# Altium schematic sheet Power Supply.SchDoc: Power Supply (part 2 of 2)
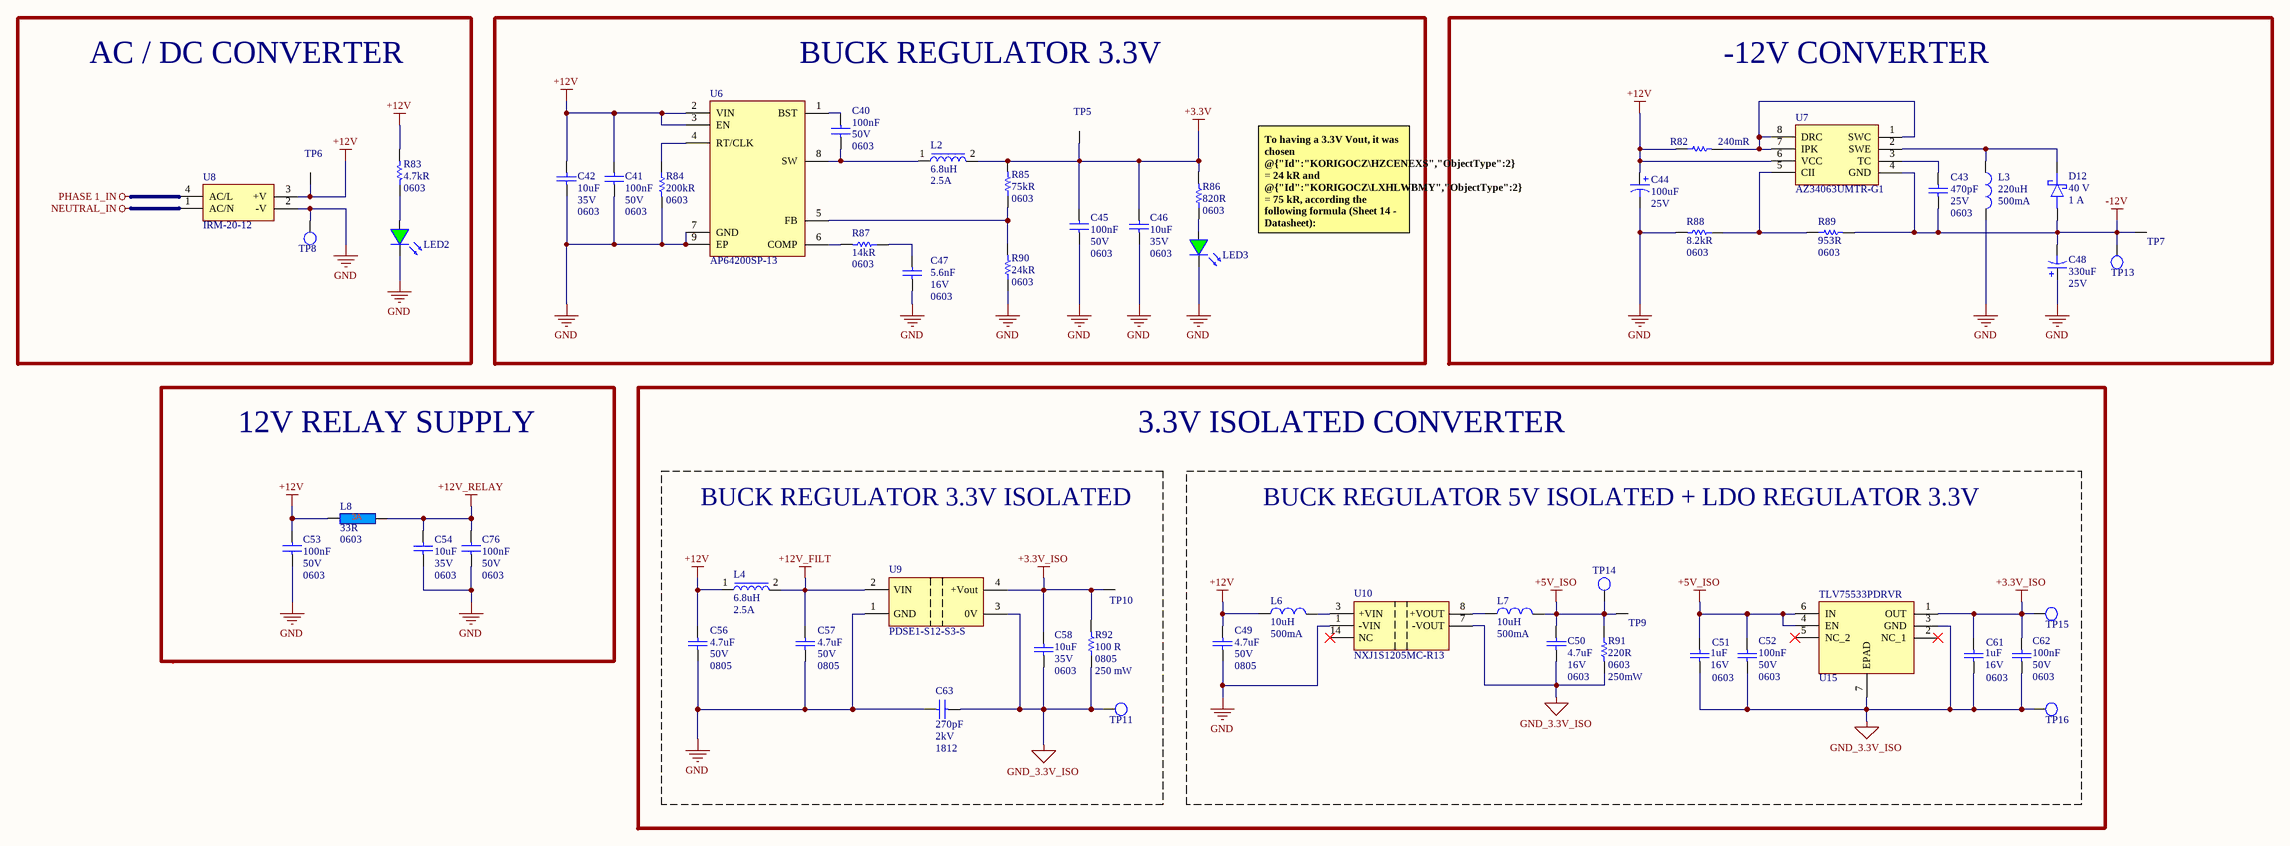
[diagram p1: Power Supply.SchDoc]

## Library data of the parts
C40 C41 C45 C52 C53 C62 C76 = C_0603_0.1uF_50V_20%: Cap Ceramic 50V 20% +Tol 20% -Tol X7R 15% TC 0.1uF SMD 0603; Manufacturer: Yageo; Supplier 1: Arrow Electronics; Manufacturer Part Number: CC0603MRX7R9BB104; RoHS: Yes; Category: Ceramic Capacitors; Stock 1: 19775; Pricing 1: 4000=0,00850, 8000=0,00780, 12000=0,00740, 28000=0,00700, 100000=0,00520 (USD); Mounting Technology: Surface Mount; Case Code (Imperial): 0603; Case Code (Metric): 1608; Min Operating Temperature: -55°C; Max Operating Temperature: 125°C; Packaging: Tape and Reel; Tolerance: 20%; Dielectric: X7R; Voltage Rating (DC): 50V; Series: CC; Length: 0.063inch; Width: 0.031inch; Thickness: 0.035inch; Lead Free: Lead Free; Halogen Free: Halogen Free; RoHS Compliant: Yes; ComponentLink1URL: http://www.yageo.com/documents/recent/UPY-GPHC_X7R_6.3V-to-50V_18.pdf?src-supplier=Digi-Key; ComponentLink1Description: http://www.yageo.com/documents/recent/UPY-GPHC_X7R_6.3V-to-50V_18.pdf?src-supplier=Digi-Key; ComponentLink2URL: https://www.yageo.com/upload/media/product/productsearch/datasheet/mlcc/UPY-GPHC_X7R_6.3V-to-50V_18.pdf?src-supplier=Digi-Key; ComponentLink2Description: https://www.yageo.com/upload/media/product/productsearch/datasheet/mlcc/UPY-GPHC_X7R_6.3V-to-50V_18.pdf?src-supplier=Digi-Key; ComponentLink3URL: http://www.yageo.com/exep/pages/download/literatures/ProductSelectionGuide%202014_Final_2.pdf?src-supplier=Digi-Key; ComponentLink3Description: http://www.yageo.com/exep/pages/download/literatures/ProductSelectionGuide%202014_Final_2.pdf?src-supplier=Digi-Key; Supplier Part Number 1: CC0603MRX7R9BB104
C42 C46 C54 C58 = C_0603_10uF_35V_20%: Cap Ceramic 10uF 35V X5R 20% Pad SMD 0603 85C T/R; Manufacturer: Murata; Manufacturer Part Number: GRM188R6YA106MA73D; Supplier 1: Arrow Electronics; RoHS: Yes; Category: Ceramic Capacitors; Stock 1: 32291; Pricing 1: 1=0,31230, 10=0,18330, 25=0,18150, 100=0,12390, 250=0,12260, 500=0,08640, 1000=0,08550, 3000=0,07600, 6000=0,06650, 15000=0,06580, 30000=0,05360 (USD); Mount: Surface Mount; Case Code (Metric): 1608; Case Code (Imperial): 0603; Min Operating Temperature: -55°C; Max Operating Temperature: 85°C; Packaging: Tape and Reel; Voltage Rating (DC): 35V; Dielectric: X5R; Length: 0.063inch; Width: 0.031inch; Thickness: 0.039inch; RoHS Compliant: Yes; ComponentLink1URL: http://search.murata.co.jp/Ceramy/image/img/A01X/G101/ENG/GRM188R6YA106MA73-01.pdf?src-supplier=Future+Electronics; ComponentLink1Description: http://search.murata.co.jp/Ceramy/image/img/A01X/G101/ENG/GRM188R6YA106MA73-01.pdf?src-supplier=Future+Electronics; ComponentLink2URL: http://search.murata.co.jp/Ceramy/image/img/A01X/G101/ENG/GRM188R6YA106MA73-01.pdf?src-supplier=Digi-Key; ComponentLink2Description: http://search.murata.co.jp/Ceramy/image/img/A01X/G101/ENG/GRM188R6YA106MA73-01.pdf?src-supplier=Digi-Key; ComponentLink3URL: https://www.murata.com/~/media/webrenewal/support/library/catalog/products/capacitor/mlcc/c02e.ashx?la=en-us&src-supplier=Digi-Key; ComponentLink3Description: https://www.murata.com/~/media/webrenewal/support/library/catalog/products/capacitor/mlcc/c02e.ashx?la=en-us&src-supplier=Digi-Key; ComponentLink4URL: http://search.murata.co.jp/Ceramy/image/img/A01X/G101/ENG/GRM188R6YA106MA73-01.pdf?src-supplier=Mouser; ComponentLink4Description: http://search.murata.co.jp/Ceramy/image/img/A01X/G101/ENG/GRM188R6YA106MA73-01.pdf?src-supplier=Mouser; ComponentLink5URL: http://search.murata.co.jp/Ceramy/image/img/A01X/G101/ENG/GRM188R6YA106MA73-01.pdf?src-supplier=TTI; ComponentLink5Description: http://search.murata.co.jp/Ceramy/image/img/A01X/G101/ENG/GRM188R6YA106MA73-01.pdf?src-supplier=TTI; Tolerance: 20%; Supplier Part Number 1: GRM188R6YA106MA73D
C43 = C_0603_470pF_25V_10%: CHIP CAP-470PF-25V-10%-X7R-0603; Manufacturer: Yageo; Tolerance: 10%; Dielectric: X7R; Supplier 1: Digi-Key; Manufacturer Part Number: CC0603KRX7R8BB471; RoHS: Yes; Category: Ceramic Capacitors; Stock 1: 19214; Pricing 1: 1=0,10000, 10=0,04800, 50=0,02620, 100=0,02140, 500=0,01528, 1000=0,01200 (USD); Mounting Technology: Surface Mount; Case Code (Imperial): 0603; Case Code (Metric): 1608; Weight: 7.1E-05oz; Min Operating Temperature: -55°C; Max Operating Temperature: 125°C; Voltage Rating (DC): 25V; Packaging: Tape and Reel; Termination: SMD/SMT; Resistor Type: Ceramic; Series: CC; Length: 0.063inch; Width: 0.031inch; Thickness: 0.035inch; Lead Free: Lead Free; Halogen Free: Halogen Free; RoHS Compliant: Yes; ComponentLink1URL: https://datasheet.ciiva.com/13208/upy-gphc-x7r-6-3v-to-50v-8-12304-13208058.pdf?src-supplier=Mouser; ComponentLink1Description: https://datasheet.ciiva.com/13208/upy-gphc-x7r-6-3v-to-50v-8-12304-13208058.pdf?src-supplier=Mouser; Supplier Part Number 1: 311-4087-1-ND
C44 = C_6.6mm X 6.6mm_100uF_25V_20%: Smd Aluminium Electrolytic Capacitor, Wcap-Asli Series, 100 uF, 25 V, Radial Can - Smd, 6.3 Mm Rohs Compliant: Yes; Manufacturer: Wurth Electronics; Tolerance: 20%; Life (Hours): 2000Hour; Ripple Current (AC): 290mA; Impedance: 380mR; Supplier 1: Rs; Manufacturer Part Number: 865080445010; RoHS: Yes; Category: Aluminum Electrolytic Capacitors; Stock 1: 360; Pricing 1: 50=0,22900, 100=0,19600, 200=0,18600, 1000=0,15200 (GBP); Mounting Technology: Surface Mount; Case/Package: Radial; Material: Aluminium; Min Operating Temperature: -55°C; Max Operating Temperature: 105°C; Voltage Rating: 25V; Packaging: Cut Tape; Series: WCAP-ASLI; Diameter: 6.3mm; Height: 7.7mm; RoHS Compliant: Yes; ComponentLink1URL: https://datasheet.ciiva.com/48693/001280461-da-01-en-wcap-asli-alu-elec-caps-865080445010-48693637.pdf?src-supplier=Conrad; ComponentLink1Description: https://datasheet.ciiva.com/48693/001280461-da-01-en-wcap-asli-alu-elec-caps-865080445010-48693637.pdf?src-supplier=Conrad; Supplier Part Number 1: 8391824P
C47 = C_0603_5600pF_16V_10%: Capacitor, Ceramic, 5.6nF, 16VDC, 10-% Tol, 10+% Tol, X7R-TC Code, -15, 15%-TC RoHS Compliant: Yes; Manufacturer: KEMET; Tolerance: 10%; Dielectric: X7R; Supplier 1: Mouser; Manufacturer Part Number: C0603C562K4RACTU; RoHS: Yes; Category: Ceramic Capacitors; Stock 1: 10749; Pricing 1: 1=0,29000, 10=0,20200, 50=0,20200, 100=0,10300, 1000=0,06200, 10000=0,05400 (USD); Mounting Technology: Surface Mount; Case/Package: 0603; Dielectric Material: Ceramic; Case Code (Metric): 1608; Min Operating Temperature: -55°C; Max Operating Temperature: 125°C; Packaging: Tape and Reel; Voltage Rating (DC): 16V; Package Quantity: 4000; Termination: SMD/SMT; Dissipation Factor: 10%; Series: SMD Comm X7R; Length: 1.6mm; Width: 0.8mm; Height: 0.8mm; Lead Pitch: 0.7mm; RoHS Compliant: Yes; ComponentLink1URL: http://www.mouser.com/ds/2/212/KEM_C1002_X7R_SMD-1102033.pdf?src-supplier=Mouser; ComponentLink1Description: http://www.mouser.com/ds/2/212/KEM_C1002_X7R_SMD-1102033.pdf?src-supplier=Mouser; ComponentLink2URL: http://components.arrow.com/part/dataview/2627857S8405979N7429?src-supplier=Arrow+Electronics; ComponentLink2Description: http://components.arrow.com/part/dataview/2627857S8405979N7429?src-supplier=Arrow+Electronics; ComponentLink3URL: https://search.kemet.com/component-edge/download/datasheet/C0603C562K4RACTU.pdf?src-supplier=Digi-Key; ComponentLink3Description: https://search.kemet.com/component-edge/download/datasheet/C0603C562K4RACTU.pdf?src-supplier=Digi-Key; Supplier Part Number 1: 80-C0603C562K4R
C48 = C_8mm X 10mm_330uF_25V_20%: Aluminum Electrolytic Capacitor, 330uF 25 V dc, WT Series 1000h 8 (Dia.) x 10mm; Manufacturer: Nichicon; Dielectric Material: Aluminium; Tolerance: 20%; Ripple Current: 190mA; Leakage Current: 3uA; Life (Hours): 1000Hour; Dissipation Factor: 0.16%; Supplier 1: Rs; Manufacturer Part Number: UWT1E331MNL1GS; RoHS: Yes; Category: Aluminum Electrolytic Capacitors; Stock 1: 2550; Pricing 1: 125=0,00752, 625=0,15700, 1875=0,12600, 3750=0,12000 (GBP); Mounting Technology: Surface Mount,PCB; Case/Package: Radial; Pins: 2; Min Operating Temperature: -55°C; Max Operating Temperature: 105°C; Package Quantity: 500; Packaging: Tape and Reel; Voltage Rating (DC): 25V; Termination: SMD/SMT; Voltage: 25V; Ripple Current (AC): 190mA; Series: WT; Construction: Cylindrical; Diameter: 8mm; Length: 10mm; Height: 10mm; Height - Seated (Max): 0.394inch; Radiation Hardening: No; Reach SVHC Compliant: Yes; Lead Free: Lead Free; RoHS Compliant: Yes; ComponentLink1URL: https://datasheet.ciiva.com/97/e-wt-97107.pdf?src-supplier=Digi-Key; ComponentLink1Description: https://datasheet.ciiva.com/97/e-wt-97107.pdf?src-supplier=Digi-Key; ComponentLink2URL: https://datasheet.ciiva.com/97/e-wt-97108.pdf?src-supplier=Digi-Key; ComponentLink2Description: https://datasheet.ciiva.com/97/e-wt-97108.pdf?src-supplier=Digi-Key; ComponentLink3URL: https://datasheet.ciiva.com/97/e-wt-97109.pdf?src-supplier=Digi-Key; ComponentLink3Description: https://datasheet.ciiva.com/97/e-wt-97109.pdf?src-supplier=Digi-Key; ComponentLink4URL: https://datasheet.ciiva.com/30522/getdatasheetpartid-457641-30522227.pdf?src-supplier=Verical; ComponentLink4Description: https://datasheet.ciiva.com/30522/getdatasheetpartid-457641-30522227.pdf?src-supplier=Verical; ComponentLink5URL: https://datasheet.ciiva.com/11782/0900766b80649b51-11782007.pdf?src-supplier=Rs; ComponentLink5Description: https://datasheet.ciiva.com/11782/0900766b80649b51-11782007.pdf?src-supplier=Rs; ComponentLink6URL: https://datasheet.ciiva.com/11686/e-wt-11686502.pdf?src-supplier=Avnet; ComponentLink6Description: https://datasheet.ciiva.com/11686/e-wt-11686502.pdf?src-supplier=Avnet; ComponentLink7URL: https://datasheet.ciiva.com/16502/e-wt-16502936.pdf?src-supplier=Future+Electronics; ComponentLink7Description: https://datasheet.ciiva.com/16502/e-wt-16502936.pdf?src-supplier=Future+Electronics; ComponentLink8URL: https://datasheet.ciiva.com/7851/e-wt-7851757.pdf?src-supplier=Element14; ComponentLink8Description: https://datasheet.ciiva.com/7851/e-wt-7851757.pdf?src-supplier=Element14; Supplier Part Number 1: 5201933P
C49 C56 C57 = C_0805_4.7uF_50V_20%: 0805 4.7 uF 50 V ±20% Tolerance X5R Surface Mount Multilayer Ceramic Capacitor; Manufacturer: Murata; Supplier 1: Arrow Electronics; Manufacturer Part Number: GRM21BR61H475ME51L; RoHS: Yes; Category: Ceramic Capacitors; Stock 1: 9948; Pricing 1: 1=0,21500, 10=0,12180, 25=0,12060, 100=0,08430, 250=0,08340, 500=0,05930, 1000=0,05140, 3000=0,04790, 6000=0,03900 (USD); Mounting Technology: Surface Mount; Case Code (Imperial): 0805; Case Code (Metric): 2012; Weight: 0.000335oz; Min Operating Temperature: -55°C; Max Operating Temperature: 85°C; Tolerance: 20%; Packaging: Tape and Reel; Dielectric: X5R; Termination: SMD/SMT; Resistor Type: Ceramic; Voltage Rating (DC): 50V; Package Quantity: 3000; Length: 2mm; Width: 0.049inch; Height: 1.25mm; Thickness: 0.055inch; Depth: 1.2mm; RoHS Compliant: Yes; ComponentLink1URL: http://www.mouser.com/ds/2/281/c02e-2905.pdf?src-supplier=Mouser; ComponentLink1Description: http://www.mouser.com/ds/2/281/c02e-2905.pdf?src-supplier=Mouser; ComponentLink2URL: http://search.murata.co.jp/Ceramy/image/img/A01X/G101/ENG/GRM21BR61H475ME51-01.pdf?src-supplier=Digi-Key; ComponentLink2Description: http://search.murata.co.jp/Ceramy/image/img/A01X/G101/ENG/GRM21BR61H475ME51-01.pdf?src-supplier=Digi-Key; ComponentLink3URL: https://search.murata.co.jp/Ceramy/image/img/A01X/G101/ENG/GRM21BR61H475ME51-01.pdf?src-supplier=Digi-Key; ComponentLink3Description: https://search.murata.co.jp/Ceramy/image/img/A01X/G101/ENG/GRM21BR61H475ME51-01.pdf?src-supplier=Digi-Key; Supplier Part Number 1: GRM21BR61H475ME51L
C50 = C_0603_4.7uF_16V_10%: CAP CER 4.7UF 16V X5R 0603; Manufacturer: Samsung; Material: Ceramic; Tolerance: 10%; Supplier 1: Mouser; Manufacturer Part Number: CL10A475KO8NNNC; RoHS: Yes; Category: Ceramic Capacitors; Stock 1: 437083; Pricing 1: 1=0,12000, 10=0,08600, 50=0,08600, 100=0,04100, 1000=0,02400, 10000=0,01700 (USD); Mounting Technology: Surface Mount; Case/Package: 0603; Case Code (Metric): 1608; Contact Plating: Tin; Min Operating Temperature: -55°C; Max Operating Temperature: 85°C; Packaging: Tape and Reel; Package Quantity: 1; Dielectric: X5R; Voltage: 16V; Construction: Flat; Length: 1.6mm; Width: 0.031inch; Height: 0.8mm; Thickness: 0.035inch; Depth: 0.8mm; Radiation Hardening: No; RoHS Compliant: Yes; Supplier Part Number 1: 187-CL10A475KO8NNNC; Series: CL
C51 C61 = C_0603_1uF_16V_10%: Cap Ceramic 1uF 16V X5R 10% Pad SMD 0603 85C; Manufacturer: Samsung; Supplier 1: Mouser; Manufacturer Part Number: CL10A105KO8NNWC; RoHS: Yes; Category: Ceramic Capacitors; Stock 1: 202659; Pricing 1: 1=0,10000, 10=0,03400, 50=0,03400, 100=0,01600, 1000=0,00900, 4000=0,00700, 8000=0,00600, 10000=0,00600, 24000=0,00500, 100000=0,00400 (USD); RoHS Compliant: Yes; Supplier Part Number 1: 187-CL10A105KO8NNWC
C63 = C_1812_270pF_2kV_2%: Ceramic Capacitor, Multilayer, Ceramic, 2000V, 2% +Tol, 2% -Tol, C0G, 30ppm/Cel TC, 0.00027uF, Surface Mount, 1812; Manufacturer: Walsin Technologies; Supplier: Mouser; Supplier Part Number: 791-1812N271G202CT; Manufacturer Part Number: 1812N271G202CT; RoHS: No; Category: Ceramic Capacitors; Stock: 1008; Pricing: 1=1,03, 10=0,769, 50=0,769, 100=0,575, 500=0,459, 1000=0,391, 2000=0,368, 5000=0,356, 10000=0,337, 25000=0,331 (USD); RoHS Compliant: Yes
D12 = D_Schottky_1N5819HWQ-7-F: Diode Schottky 40V 1A 2-Pin SOD-123 T/R; Manufacturer: Diodes; Supplier 1: Mouser; RoHS: Yes; Stock 1: 10115; Pricing 1: 1=0,42000, 10=0,31600, 50=0,31600, 100=0,19700, 500=0,13600, 1000=0,10500, 3000=0,09500, 6000=0,09100, 9000=0,08300, 10000=0,08300, 24000=0,07100 (USD); Supplier Part Number 1: 621-1N5819HWQ-7-F; Manufacturer Part Number: 1N5819HWQ-7-F
L2 L4 = L_6.8uH_20%_2.5A: Inductor Power Shielded Wirewound 6.8uH 20% 100kHz Ferrite 2.5A 2424 Emboss T/R; Manufacturer: Taiyo Yuden; Supplier 1: Newark; Manufacturer Part Number: LSXND6060WHL6R8MMG; RoHS: No; Category: Fixed Inductors; Stock 1: 2000; Pricing 1: 1=0,37000, 10=0,33200, 25=0,29700, 50=0,26300, 100=0,22800 (USD); Supplier Part Number 1: 50AK8880
L3 = L_220uH_20%_500mA: Ind Power Shielded Wirewound 220uH ±20% 100kHz Ferrite 0.5A T/R; Manufacturer: Bourns; Saturation Current: 240mA; DC Resistance (DCR): 1.25R; Self Resonant Frequency: 5.5MHz; Supplier 1: Newark; Manufacturer Part Number: SRR4828A-221M; RoHS: Yes; Category: Fixed Inductors; Stock 1: 171; Pricing 1: 1=0,76200, 10=0,67600, 25=0,63200, 50=0,54400, 100=0,50000, 250=0,47300 (USD); Mounting Technology: Surface Mount; Case/Package: Nonstandard; Core Material: Ferrite; Min Operating Temperature: -40°C; Max Operating Temperature: 150°C; Resistor Type: Wirewound; Packaging: Tape and Reel; Tolerance: 20%; Shielding: Shielded; Test Frequency: 100kHz; Ratings: AEC-Q200; RoHS Compliant: Yes; ComponentLink1URL: https://www.bourns.com/docs/Product-Datasheets/SRR4828A.pdf?src-supplier=Digi-Key; ComponentLink1Description: https://www.bourns.com/docs/Product-Datasheets/SRR4828A.pdf?src-supplier=Digi-Key; Supplier Part Number 1: 31AC7044
L6 L7 = L_Standard_10uH_500mA_10%: General Purpose Inductor, 10uH, 10%, 1 Element, Iron-Core, SMD, 1210; Manufacturer: Murata; Manufacturer Series: 8200; Core Material: Ferrite; Channels: 1; Case/Size Code: 1210; DC Resistance (DCR): 400mR; Inductor Application: POWER INDUCTOR; Quality Factor-Min (at L-nom): 35; Self Resonant Frequency: 38MHz; Shape/Size Description: RECTANGULAR PACKAGE; Shielding: Unshielded; Test Frequency: 10kHz; Package Length: 3.2mm; Package Height: 2mm; Package Width: 2.5mm; Supplier: Digikey; Supplier Part Number: 811-2473-1-ND; Manufacturer Part Number: 82103C; RoHS: Yes; Category: Fixed Inductors; Stock: 9633; Pricing: 1=0,67, 10=0,576, 25=0,5276, 50=0,4798, 100=0,427, 250=0,403, 500=0,34542, 1000=0,30704 (USD); Pins: 2; Terminal Finish: Tin; Min Operating Temperature: -40°C; Max Operating Temperature: 85°C; Tolerance: 10%; Package Style: SMTMeter; JESD-609 Code: e3; Construction: Chip; Series: 8200; Surface Mount: Yes; Termination: Wraparound; Inductor Type: GENERAL PURPOSE INDUCTOR; Packaging: Tape and Reel; Terminal Placement: Dual Ended; Reach SVHC Compliant: Yes; RoHS Compliant: Yes; ComponentLink1URL: https://datasheet.ciiva.com:443/pdfs/VipMasterIC/IC/MUPS/MUPSS01165/MUPSS01165-1.pdf?src-supplier=IHS+Markit; ComponentLink1Description: https://datasheet.ciiva.com:443/pdfs/VipMasterIC/IC/MUPS/MUPSS01165/MUPSS01165-1.pdf?src-supplier=IHS+Markit; ComponentLink2URL: https://datasheet.ciiva.com/6690/kmp-8200c-6690973.pdf?src-supplier=Digikey; ComponentLink2Description: https://datasheet.ciiva.com/6690/kmp-8200c-6690973.pdf?src-supplier=Digikey; ComponentLink3URL: https://datasheet.ciiva.com/6690/kmp-8200c-6690974.pdf?src-supplier=Digikey; ComponentLink3Description: https://datasheet.ciiva.com/6690/kmp-8200c-6690974.pdf?src-supplier=Digikey; ComponentLink4URL: https://datasheet.ciiva.com/6690/kmp-8200c-6690975.pdf?src-supplier=Digikey; ComponentLink4Description: https://datasheet.ciiva.com/6690/kmp-8200c-6690975.pdf?src-supplier=Digikey
L8 = L_0603_25%_3A: Ferrite Beads Multi-Layer Power 33Ohm 25% 100MHz 3A 0.025Ohm DCR 0603 Automotive T/R; Manufacturer: Murata; Number of Lines: 1; DC Resistance: 250mR; Supplier 1: Mouser; Manufacturer Part Number: BLM18PG330SZ1D; RoHS: Yes; Category: Ferrite Beads and Chips; Stock 1: 39713; Pricing 1: 1=0,10000, 10=0,06700, 50=0,06700, 100=0,03600, 1000=0,02900, 10000=0,02300 (USD); Mounting Technology: Surface Mount; Min Operating Temperature: -55°C; Max Operating Temperature: 125°C; Series: EMIFIL®, BLM18; Ratings: AEC-Q200; RoHS Compliant: Yes; Supplier Part Number 1: 81-BLM18PG330SZ1D; Max Current Rating: 3A
LED2 LED3 = LED_0603_Green: Smd, Alingap, 0603, Thin, Grn, 571Nm, 35Mcd, Clr, T/R Rohs Compliant: Yes; Manufacturer: Vishay Lite-On; Manufacturer Part Number: LTST-C191KGKT; Lens Color: Colorless; Viewing Angle: 130°; Forward Voltage: 2V; Test Current: 20mA; Lens Transparency: Clear; Wavelength: 574nm; Lens Style: Rectangular,Colorless; Forward Current: 30mA; Number of Elements: 1; Power Dissipation: 75mW; Reverse Voltage: 5V; Supplier 1: RSComponents; RoHS: Yes; Category: LEDs; Stock 1: 36950; Pricing 1: 50=0,16500, 250=0,07500, 500=0,07100, 1250=0,06000, 2500=0,05700, 50=0,11900, 250=0,05400, 500=0,05100, 1250=0,04300, 2500=0,04100 (USD); Mount: Surface Mount; Case/Package: 0603; Number of Pins: 2; Color: Green; Case Code (Metric): 1608; Case Code (Imperial): 0603; Min Operating Temperature: -55°C; Max Operating Temperature: 85°C; Luminous Intensity: 35mcd; Packaging: Tape and Reel; Package Quantity: 1; Dominant Wavelength: 571nm; Illumination Color: Green; Number of LEDs: 1; Power Rating: 75mW; Max Power Dissipation: 75mW; Length: 1.6mm; Width: 0.8mm; Height: 0.55mm; Depth: 0.8mm; Radiation Hardening: No; Lead Free: Lead Free; RoHS Compliant: Yes; ComponentLink1URL: https://datasheet.ciiva.com/2109/ltst-c191kgkt-2109973.pdf?src-supplier=Digi-Key; ComponentLink1Description: https://datasheet.ciiva.com/2109/ltst-c191kgkt-2109973.pdf?src-supplier=Digi-Key; Supplier Part Number 1: 6921010
R82 = R_0805_0.24R_5%_1/2W: Res Current Sense Thick Film 0805 0.24 Ohm 5% 1/2W ±100ppm/°C Molded Paper T/R; Manufacturer: Panasonic; Max Power Dissipation: 500mW; Supplier 1: Arrow Electronics; Manufacturer Part Number: ERJ-6DQJR24V; RoHS: Yes; Category: Chip SMD Resistors; Stock 1: 6980; Pricing 1: 1=0,13820, 10=0,06220, 25=0,03230, 50=0,03080, 100=0,02930, 250=0,02770, 500=0,02620, 1000=0,02470, 3000=0,02310, 6000=0,02160 (USD); Case Code (Metric): 2012; Case Code (Imperial): 0805; Min Operating Temperature: -55°C; Max Operating Temperature: 155°C; Packaging: Tape and Reel; Resistor Type: Thick Film; Number of Terminations: 2; Tolerance: 5%; Temperature Coefficient: 100ppm/°C; Features: Automotive AEC-Q200; Length: 0.079inch; Width: 0.049inch; Height: 0.028inch; ComponentLink1URL: https://industrial.panasonic.com/cdbs/www-data/pdf/RDN0000/AOA0000C313.pdf?src-supplier=Digi-Key; ComponentLink1Description: https://industrial.panasonic.com/cdbs/www-data/pdf/RDN0000/AOA0000C313.pdf?src-supplier=Digi-Key; Supplier Part Number 1: ERJ-6DQJR24V
R83 = R_0603_4.7k_1%_1/10W: Res Thick Film 0603 4.7K Ohm 1% 0.1W(1/10W) ±100ppm/C Pad SMD T/R; Manufacturer: Mitsubishi Kamaya; Manufacturer Part Number: RMC16K472FTP; Power Rating: 100mW; Voltage Rating: 50V; Number of Resistors: 1; Mount: Surface Mount; Case/Package: 0603; Case Code (Metric): 1608; Min Operating Temperature: -55°C; Max Operating Temperature: 155°C; Tolerance: 1%; Technology: THICK FILM; Supplier 1: Mouser; RoHS: No; Category: Uncategorized; Supplier Part Number 1: 791-RMC16K472FTP
R84 = R_0603_200kR_1%_1/10W_25PPM: Res Thin Film 0603 200K Ohm 1% 1/10W ±25ppm/°C Molded SMD Paper T/R; Manufacturer: Yageo; Max Power Dissipation: 100mW; Supplier 1: Mouser; Manufacturer Part Number: RT0603FRD07200KL; RoHS: Yes; Category: Chip SMD Resistors; Stock 1: 13355; Pricing 1: 1=0,15000, 10=0,12000, 50=0,12000, 100=0,03000, 1000=0,02000, 10000=0,01600 (USD); Min Operating Temperature: -55°C; Max Operating Temperature: 155°C; Packaging: Tape and Reel; Resistor Type: Thin Film; Number of Terminations: 2; Tolerance: 1%; Features: Moisture Resistant; Length: 0.063inch; Width: 0.031inch; Height: 0.022inch; RoHS Compliant: Yes; ComponentLink1URL: http://www.yageo.com/documents/recent/PYu-RT_1-to-0.01_RoHS_L_8.pdf?src-supplier=Digi-Key; ComponentLink1Description: http://www.yageo.com/documents/recent/PYu-RT_1-to-0.01_RoHS_L_8.pdf?src-supplier=Digi-Key; Supplier Part Number 1: 603-RT0603FRD07200KL; Temperature Coefficient: 25ppm/°C
R85 = R_0603_75kR_1%_1/10W: Res Thick Film 0603 75K Ohm 1% 0.1W(1/10W) ±100ppm/C Pad SMD Automotive T/R; Manufacturer: Panasonic; Temperature Coefficient: 100ppm/°C; Power Rating: 100mW; Voltage Rating: 75V; Voltage Rating (DC): 50V; Supplier 1: Rs; Manufacturer Part Number: ERJ-3EKF7502V; RoHS: Yes; Category: Chip SMD Resistors; Stock 1: 165137; Pricing 1: 5000=0,00600 (GBP); Mounting Technology: Surface Mount; Contact Plating: Tin; Case Code (Metric): 1608; Case Code (Imperial): 0603; Min Operating Temperature: -55°C; Max Operating Temperature: 155°C; Tolerance: 1%; Resistor Type: Thick Film; Packaging: Tape and Reel; Package Quantity: 1; Number of Terminations: 2; Termination: SMD/SMT; Max Power Dissipation: 100mW; Features: Automotive AEC-Q200; Series: ERJ; Construction: Rectangular; Resistance Tolerance: 1%; Technology: THICK FILM; Length: 1.6mm; Width: 0.8mm; Height: 0.45mm; Depth: 0.8mm; Radiation Hardening: No; Reach SVHC Compliant: Yes; Military Standard: Not; Lead Free: Lead Free; RoHS Compliant: Yes; ComponentLink1URL: https://datasheet.ciiva.com/34303/1988401-34303605.pdf?src-supplier=Jameco; ComponentLink1Description: https://datasheet.ciiva.com/34303/1988401-34303605.pdf?src-supplier=Jameco; ComponentLink2URL: https://datasheet.ciiva.com/46374/426256-46374235.pdf?src-supplier=Element14; ComponentLink2Description: https://datasheet.ciiva.com/46374/426256-46374235.pdf?src-supplier=Element14; ComponentLink3URL: https://datasheet.ciiva.com/28596/1678782-28596232.pdf?src-supplier=Element14; ComponentLink3Description: https://datasheet.ciiva.com/28596/1678782-28596232.pdf?src-supplier=Element14; ComponentLink4URL: https://datasheet.ciiva.com/28676/1678782-28676971.pdf?src-supplier=Element14; ComponentLink4Description: https://datasheet.ciiva.com/28676/1678782-28676971.pdf?src-supplier=Element14; ComponentLink5URL: https://datasheet.ciiva.com/24069/aoa0000ce2-24069064.pdf?src-supplier=Mouser; ComponentLink5Description: https://datasheet.ciiva.com/24069/aoa0000ce2-24069064.pdf?src-supplier=Mouser; ComponentLink6URL: https://datasheet.ciiva.com/9187/aoa0000ce2-9187719.pdf?src-supplier=Avnet; ComponentLink6Description: https://datasheet.ciiva.com/9187/aoa0000ce2-9187719.pdf?src-supplier=Avnet; ComponentLink7URL: https://datasheet.ciiva.com/48531/aoa0000ce2-48531550.pdf?src-supplier=Avnet; ComponentLink7Description: https://datasheet.ciiva.com/48531/aoa0000ce2-48531550.pdf?src-supplier=Avnet; ComponentLink8URL: https://datasheet.ciiva.com/31835/aoa0000ce2-31835674.pdf?src-supplier=Onlinecomponents.com; ComponentLink8Description: https://datasheet.ciiva.com/31835/aoa0000ce2-31835674.pdf?src-supplier=Onlinecomponents.com; ComponentLink9URL: https://datasheet.ciiva.com/15159/getdatasheetpartid-28812-15159210.pdf?src-supplier=Verical; ComponentLink9Description: https://datasheet.ciiva.com/15159/getdatasheetpartid-28812-15159210.pdf?src-supplier=Verical; Supplier Part Number 1: 1065972
R86 = R_0603_820R_5%_1/8W: Res Thick Film 0603 820 Ohm 5% 0.125W(1/8W) ±200ppm/C Pad SMD Automotive T/R; Manufacturer: KOA Speer; Power Rating: 100mW; Voltage Rating: 50V; Temperature Coefficient: 200ppm/°C; Max Power Dissipation: 125mW; Supplier 1: Arrow Electronics; Manufacturer Part Number: RK73B1JTTD821J; RoHS: Yes; Category: Chip SMD Resistors; Stock 1: 4950; Pricing 1: 1=0,0869, 10=0,0146, 25=0,0145, 100=0,0056, 500=0,0053, 1000=0,0027, 3000=0,0023 (USD); Case/Package: 0603; Pins: 2; Case Code (Metric): 1608; Min Operating Temperature: -55°C; Max Operating Temperature: 155°C; Tolerance: 5%; Packaging: Tape and Reel; Package Quantity: 5000; Resistor Type: Thick Film; Termination: SMD/SMT; Voltage Rating (DC): 50V; Series: RK73B; Technology: THICK FILM; Construction: Rectangular; Resistance Tolerance: 5%; Features: Moisture Resistant,Automotive AEC-Q200; Number of Terminations: 2; Length: 1.6mm; Width: 0.8mm; Height: 0.45mm; Depth: 0.8mm; Ratings: AEC-Q200; Military Standard: Not; Lead Free: Lead Free; RoHS Compliant: Yes; ComponentLink1URL: https://datasheet.ciiva.com/7706/548635-7706024.pdf?src-supplier=Element14; ComponentLink1Description: https://datasheet.ciiva.com/7706/548635-7706024.pdf?src-supplier=Element14; Supplier Part Number 1: RK73B1JTTD821J
R87 = R_0603_14kR_1%_1/10W: Res General Purpose Thick Film 0603 14K Ohm 1% 1/10W ±100ppm/°C Molded SMD Paper T/R; Manufacturer: Yageo; Manufacturer Part Number: RC0603FR-0714KL; Power Rating: 100mW; Voltage Rating: 75V; Voltage Rating (DC): 50V; Supplier 1: Digi-Key; RoHS: Yes; Category: Chip SMD Resistors; Stock 1: 119359; Pricing 1: 1=0,10000, 10=0,02400, 100=0,00970, 1000=0,00436, 2500=0,00378 (USD); Case Code (Metric): 1608; Case Code (Imperial): 0603; Weight: 7.1E-05oz; Min Operating Temperature: -55°C; Max Operating Temperature: 155°C; Tolerance: 1%; Packaging: Tape and Reel; Package Quantity: 1; Resistor Type: Thick Film; Number of Terminations: 2; Termination: SMD/SMT; Max Power Dissipation: 100mW; Temperature Coefficient: 100ppm/°C; Features: Moisture Resistant; Series: RC; Construction: Rectangular; Length: 1.6mm; Width: 0.031inch; Height: 0.022inch; Depth: 0.8mm; Military Standard: Not; Lead Free: Lead Free; RoHS Compliant: Yes; ComponentLink1URL: https://datasheet.ciiva.com/15189/getdatasheetpartid-325152-15189610.pdf?src-supplier=Verical; ComponentLink1Description: https://datasheet.ciiva.com/15189/getdatasheetpartid-325152-15189610.pdf?src-supplier=Verical; ComponentLink2URL: https://datasheet.ciiva.com/2455/pyu-r-int-thick-7-2455089.pdf?src-supplier=Digi-Key; ComponentLink2Description: https://datasheet.ciiva.com/2455/pyu-r-int-thick-7-2455089.pdf?src-supplier=Digi-Key; ComponentLink3URL: https://datasheet.ciiva.com/2455/pyu-r-int-thick-7-2455090.pdf?src-supplier=Digi-Key; ComponentLink3Description: https://datasheet.ciiva.com/2455/pyu-r-int-thick-7-2455090.pdf?src-supplier=Digi-Key; ComponentLink4URL: https://datasheet.ciiva.com/2455/pyu-r-int-thick-7-2455091.pdf?src-supplier=Digi-Key; ComponentLink4Description: https://datasheet.ciiva.com/2455/pyu-r-int-thick-7-2455091.pdf?src-supplier=Digi-Key; Supplier Part Number 1: 311-14.0KHRCT-ND; Size Code: 0603
R88 = R_0603_8.2kR_1%_1/10W: 8.2K F 1/16 0603; Manufacturer: Mitsubishi Kamaya; Tolerance: 1%; Supplier 1: Mouser; Manufacturer Part Number: RMC1/16K8201FTP; RoHS: No; Category: Uncategorized; Stock 1: 35000; Pricing 1: 1=0,10000, 10=0,01200, 50=0,01200, 100=0,00500, 1000=0,00300, 10000=0,00100 (USD); Min Operating Temperature: -55°C; Max Operating Temperature: 155°C; Packaging: Tape and Reel; Resistor Type: Thick Film; Length: 1.6mm; Depth: 0.8mm; Military Standard: Not; ComponentLink1URL: https://datasheet.ciiva.com/26894/getdatasheetpartid-568716-26894317.pdf?src-supplier=Verical; ComponentLink1Description: https://datasheet.ciiva.com/26894/getdatasheetpartid-568716-26894317.pdf?src-supplier=Verical; Supplier Part Number 1: 791-RMC1/16K8201FTP
R89 = R_0603_953R_1%_1/10W: Res Thick Film 0603 953 Ohm 1% 0.1W(1/10W) ±100ppm/C Pad SMD T/R; Manufacturer: Yageo; Power Rating: 100mW; Voltage Rating: 50V; Temperature Coefficient: 100ppm/°C; Supplier 1: Future Electronics; Manufacturer Part Number: RC0603FR-07953RL; RoHS: Yes; Category: Chip SMD Resistors; Stock 1: 205000; Pricing 1: 5000=0,0014, 50000=0,0013, 200000=0,0012, 625000=0,0012, 2000000=0,0011 (USD); Case Code (Metric): 1608; Case Code (Imperial): 0603; Min Operating Temperature: -55°C; Max Operating Temperature: 155°C; Tolerance: 1%; Package Quantity: 5000; Packaging: Tape and Reel; Number of Terminations: 2; Termination: SMD/SMT; Max Power Dissipation: 100mW; Voltage Rating (DC): 50V; Features: Moisture Resistant; Series: RC; Length: 1.6mm; Width: 0.8mm; Height: 0.45mm; Lead Free: Lead Free; RoHS Compliant: Yes; ComponentLink1URL: https://datasheet.ciiva.com/12560/rc0603-272842-12560878.pdf?src-supplier=Mouser; ComponentLink1Description: https://datasheet.ciiva.com/12560/rc0603-272842-12560878.pdf?src-supplier=Mouser; ComponentLink2URL: https://datasheet.ciiva.com/2455/pyu-r-int-thick-7-2455068.pdf?src-supplier=Digi-Key; ComponentLink2Description: https://datasheet.ciiva.com/2455/pyu-r-int-thick-7-2455068.pdf?src-supplier=Digi-Key; ComponentLink3URL: https://datasheet.ciiva.com/2455/pyu-r-int-thick-7-2455069.pdf?src-supplier=Digi-Key; ComponentLink3Description: https://datasheet.ciiva.com/2455/pyu-r-int-thick-7-2455069.pdf?src-supplier=Digi-Key; ComponentLink4URL: https://datasheet.ciiva.com/2455/pyu-r-int-thick-7-2455070.pdf?src-supplier=Digi-Key; ComponentLink4Description: https://datasheet.ciiva.com/2455/pyu-r-int-thick-7-2455070.pdf?src-supplier=Digi-Key; Supplier Part Number 1: 3520228
R90 = R_0603_24kR_1%_1/10W: Res Thin Film 0603 24K Ohm 1% 1/10W ±50ppm/°C Molded SMD SMD Paper T/R; Manufacturer: Yageo; Power Rating: 100mW; Voltage Rating: 75V; Voltage Rating (DC): 50V; Supplier 1: Future Electronics; Manufacturer Part Number: RT0603FRE0724KL; RoHS: Yes; Category: Chip SMD Resistors; Stock 1: 125000; Pricing 1: 5000=0,00320, 20000=0,00300, 100000=0,00280, 200000=0,00280, 625000=0,00260 (USD); Case Code (Metric): 1608; Case Code (Imperial): 0603; Contact Plating: Tin,Matte; Min Operating Temperature: -55°C; Max Operating Temperature: 125°C; Tolerance: 1%; Packaging: Tape and Reel; Package Quantity: 5000; Resistor Type: Thin Film; Termination: SMD/SMT; Number of Terminations: 2; Temperature Coefficient: 50ppm/°C; Max Power Dissipation: 100mW; Series: RT; Construction: Rectangular; Length: 0.063inch; Width: 0.031inch; Height: 0.022inch; Depth: 0.8mm; Radiation Hardening: No; Military Standard: Not; Lead Free: Lead Free; RoHS Compliant: Yes; ComponentLink1URL: https://datasheet.ciiva.com/2559/pyu-rt-1-to-0-05-rohs-l-5-2559675.pdf?src-supplier=Digi-Key; ComponentLink1Description: https://datasheet.ciiva.com/2559/pyu-rt-1-to-0-05-rohs-l-5-2559675.pdf?src-supplier=Digi-Key; ComponentLink2URL: https://datasheet.ciiva.com/8890/pyu-rt-1-to-0-05-rohs-l-4-8890053.pdf?src-supplier=Avnet; ComponentLink2Description: https://datasheet.ciiva.com/8890/pyu-rt-1-to-0-05-rohs-l-4-8890053.pdf?src-supplier=Avnet; ComponentLink3URL: https://datasheet.ciiva.com/12705/pyu-rt-1-to-0-05-rohs-l-4-12705429.pdf?src-supplier=Mouser; ComponentLink3Description: https://datasheet.ciiva.com/12705/pyu-rt-1-to-0-05-rohs-l-4-12705429.pdf?src-supplier=Mouser; Supplier Part Number 1: 8202798
R91 = R_0603_220R_1%_1/4W: Fixed Resistor, Metal Glaze/thick Film, 0.25W, 220ohm, 75V, 1% +/-Tol, 100ppm/Cel, Surface Mount, 0603; Manufacturer: Vishay Dale; Temperature Coefficient: -100100ppm/°C; Package Height: 0.45mm; Package Length: 1.55mm; Package Width: 0.85mm; Reference Standard: AEC-Q200; Supplier: Mouser; Supplier Part Number: 71-RCS0603220RFKEA; Manufacturer Part Number: RCS0603220RFKEA; RoHS: Yes; Category: Chip SMD Resistors; Stock: 9343; Pricing: 1=0,13, 10=0,044, 50=0,044, 100=0,027, 1000=0,022, 10000=0,015 (USD); Pins: 2; Package Shape: Rectangular; Terminal Finish: Nickel; Min Operating Temperature: -55°C; Max Operating Temperature: 155°C; Tolerance: 1%; JESD-609 Code: e3; Resistor Type: FIXED RESISTOR; Construction: Rectangular; Packaging: Tape and Reel; Technology: METAL GLAZE/THICK FILM; Working Voltage: 75V; RoHS Compliant: Yes; Reach SVHC Compliant: Yes; ComponentLink1URL: https://datasheet.ciiva.com:443/pdfs/VipMasterIC/IC/VISH/VISH-S-A0007978036/VISH-S-A0007978036-1.pdf?src-supplier=IHS+Markit; ComponentLink1Description: https://datasheet.ciiva.com:443/pdfs/VipMasterIC/IC/VISH/VISH-S-A0007978036/VISH-S-A0007978036-1.pdf?src-supplier=IHS+Markit; ComponentLink2URL: http://www.vishay.com/docs/20065/rcse3.pdf?src-supplier=Digikey; ComponentLink2Description: http://www.vishay.com/docs/20065/rcse3.pdf?src-supplier=Digikey; ComponentLink3URL: https://www.vishay.com/docs/20065/rcse3.pdf?src-supplier=Digikey; ComponentLink3Description: https://www.vishay.com/docs/20065/rcse3.pdf?src-supplier=Digikey
R92 = R_0805_100R_1/4W_1%: Chip Resistor Automotive Grade Thick Film 0805 100Ohm 1% Paper T/R; Manufacturer: Yageo; Supplier 1: Newark; Manufacturer Part Number: AC0805FR-7W100RL; RoHS: Yes; Category: Chip SMD Resistors; Stock 1: 23240; Pricing 1: 10=0,064, 25=0,052, 50=0,04, 100=0,027 (USD); RoHS Compliant: Yes; Supplier Part Number 1: 31AK9313
TP5-TP7 TP9 TP10 = TP_S2761-46R_SMT: Natural PC Test Point 0.063 x 0.031 x 0.045 (1.60mm x 0.80mm x 1.15mm) Brass, Tin Plating Surface Mount Mounting Type; Manufacturer: Harwin; Supplier: Digi-Key; Supplier Part Number: 952-2665-1-ND; Manufacturer Part Number: S2761-46R; RoHS: Yes; Category: Headers and Wire Housings; Stock: 224369; Pricing: 1=0,31000, 10=0,26400, 25=0,23280, 50=0,21380, 100=0,20540, 250=0,18444, 500=0,17604, 1000=0,14670 (USD); Mounting Technology: Surface Mount; Color: Natural; Plating: Tin; Body Material: Brass; Weight: 0.000212oz; Packaging: Cut Tape; Package Quantity: 3000; Series: S2761, EZ BoardWare; Length: 1.6mm; RoHS Compliant: Yes; ComponentLink1URL: https://cdn.harwin.com/pdfs/S2761R.pdf?src-supplier=Newark; ComponentLink1Description: https://cdn.harwin.com/pdfs/S2761R.pdf?src-supplier=Newark; ComponentLink2URL: https://cdn.harwin.com/pdfs/Harwin_PC_PCB_Hardware.pdf?src-supplier=Mouser; ComponentLink2Description: https://cdn.harwin.com/pdfs/Harwin_PC_PCB_Hardware.pdf?src-supplier=Mouser; ComponentLink3URL: https://cdn.harwin.com/pdfs/Harwin_PC_PCB_Hardware.pdf?src-supplier=Digi-Key; ComponentLink3Description: https://cdn.harwin.com/pdfs/Harwin_PC_PCB_Hardware.pdf?src-supplier=Digi-Key; ComponentLink4URL: https://cdn.harwin.com/pdfs/Harwin_PC_PCB_Hardware.pdf?src-supplier=TTI; ComponentLink4Description: https://cdn.harwin.com/pdfs/Harwin_PC_PCB_Hardware.pdf?src-supplier=TTI
TP8 TP11 = TP_PTH: TEST POINT PC MINI .040D BLACK; Manufacturer: Keystone Electronics; Manufacturer Part Number: 5001; Body Material: Bronze; Plating: Silver; Number of Ports: 1; Insulation: Insulated; Outside Diameter: 2.54mm; Inside Diameter: 1.27mm; Hole Diameter: 1.6mm; Supplier 1: Newark; RoHS: Yes; Category: Connectors; Stock 1: 180653; Pricing 1: 1=0,24600, 10=0,23700, 100=0,20900, 500=0,16600, 1000=0,14100, 2500=0,11600, 10000=0,10400 (USD); Mounting Technology: Through Hole; Contact Material: Bronze; Contact Plating: Tin,Silver; Color: Black; Housing Color: Black; Material: Nylon,Bronze,Silver; Insulation Material: Nylon; Package Quantity: 100; Packaging: Bulk; Series: THM; Termination: Through Hole; Orientation: Straight; Number of Contacts: 1; Diameter: 2.54mm; Length: 7.62mm; RoHS Compliant: Yes; Reach SVHC Compliant: No; Lead Free: Lead Free; ComponentLink1URL: https://datasheet.ciiva.com/27052/1581986-27052611.pdf?src-supplier=Jameco; ComponentLink1Description: https://datasheet.ciiva.com/27052/1581986-27052611.pdf?src-supplier=Jameco; ComponentLink2URL: https://datasheet.ciiva.com/11836/0900766b8009b7c7-11836045.pdf?src-supplier=Rs; ComponentLink2Description: https://datasheet.ciiva.com/11836/0900766b8009b7c7-11836045.pdf?src-supplier=Rs; ComponentLink3URL: https://datasheet.ciiva.com/16318/m60-2p60-16318423.pdf?src-supplier=Future+Electronics; ComponentLink3Description: https://datasheet.ciiva.com/16318/m60-2p60-16318423.pdf?src-supplier=Future+Electronics; ComponentLink4URL: https://datasheet.ciiva.com/22631/1703983-22631100.pdf?src-supplier=Element14; ComponentLink4Description: https://datasheet.ciiva.com/22631/1703983-22631100.pdf?src-supplier=Element14; Supplier Part Number 1: 62W5135
U6 = U_AP64200SP-13_SO-8EP: Switching Voltage Regulators DCDC Conv HV Buck SO-8EP(STD) T&R 4K; Manufacturer: Diodes; Supplier 1: Avnet; Manufacturer Part Number: AP64200SP-13; RoHS: Yes; Category: Voltage Regulators - Switching; Stock 1: 12000; Pricing 1: 4000=0,60636, 8000=0,58463, 16000=0,56704, 24000=0,55049, 32000=0,52979, 40000=0,52151, 400000=0,51324 (USD)
U7 = U_AZ34063UMTR-G1: IC REG BUCK BOOST INV ADJ 8SOIC; Manufacturer: Diodes; Number of Outputs: 1; Output Voltage: 36V; Max Output current: 1.5A; Min Input Voltage: 3V; Min Output Voltage: 1.25V; Output Type: Adjustable; Switching Frequency: 180kHz; Synchronous Rectifier: No; Operating Supply Current: 4mA; Supplier 1: Future Electronics; RoHS: Yes; Category: Voltage Regulators - Switching; Stock 1: 32000; Pricing 1: 4000=0,15400, 12000=0,15000, 16000=0,14900, 40000=0,14500, 60000=0,14200 (USD); Mounting Technology: Surface Mount; Case/Package: SOIC; Pins: 8; Weight: 0.00261oz; Min Operating Temperature: -40°C; Max Operating Temperature: 85°C; Packaging: Tape and Reel; Max Supply Voltage: 36V; Package Quantity: 4000; Output Current: 1.5A; Max Output Voltage: 36V; Min Supply Voltage: 3V; Operating Supply Voltage: 36V; Length: 5.1mm; Width: 4mm; Height: 1.45mm; Lead Free: Lead Free; RoHS Compliant: Yes; ComponentLink1URL: https://datasheet.ciiva.com/29734/az34063u-29734577.pdf?src-supplier=Digi-Key; ComponentLink1Description: https://datasheet.ciiva.com/29734/az34063u-29734577.pdf?src-supplier=Digi-Key; ComponentLink2URL: https://datasheet.ciiva.com/29734/az34063u-29734583.pdf?src-supplier=Digi-Key; ComponentLink2Description: https://datasheet.ciiva.com/29734/az34063u-29734583.pdf?src-supplier=Digi-Key; ComponentLink3URL: https://datasheet.ciiva.com/29734/az34063u-29734572.pdf?src-supplier=Digi-Key; ComponentLink3Description: https://datasheet.ciiva.com/29734/az34063u-29734572.pdf?src-supplier=Digi-Key; Supplier Part Number 1: 1042342; Manufacturer Part Number: AZ34063UMTR-G1
U8 = U_IRM-20-12_MODULE: AC/DC 20W 12V Single Output Power Supply, Encapsulated Board Mount Module; Manufacturer: Mean Well; Number of Outputs: 1; Output Power: 21.6W; Current - Output 1: 1.8A; Efficiency: 84%; Approvals: UL,CE,TUV,CB; Supplier 1: Mouser; RoHS: Yes; Category: Board Mount Modules; Stock 1: 969; Pricing 1: 1=12,21000, 10=11,86000, 50=10,82000, 100=10,47000, 1000=9,76000, 10000=9,76000 (USD); Mounting Technology: Through Hole,PCB; Pins: 4; Weight: 2.081164oz; Min Operating Temperature: -30°C; Max Operating Temperature: 70°C; Packaging: Bulk; Package Quantity: 240; Voltage - Output 1: 12V; Output Current: 1.8A; Max Output Power: 21.6W; Length: 53mm; Width: 28mm; Height: 24mm; RoHS Compliant: Yes; Lead Free: Lead Free; ComponentLink1URL: https://datasheet.ciiva.com/24117/irm-20-spec-267992-24117345.pdf?src-supplier=Mouser; ComponentLink1Description: https://datasheet.ciiva.com/24117/irm-20-spec-267992-24117345.pdf?src-supplier=Mouser; ComponentLink2URL: https://datasheet.ciiva.com/30198/irm-20-spec-30198540.pdf?src-supplier=Onlinecomponents.com; ComponentLink2Description: https://datasheet.ciiva.com/30198/irm-20-spec-30198540.pdf?src-supplier=Onlinecomponents.com; Supplier Part Number 1: 709-IRM20-12; Manufacturer Part Number: IRM-20-12
U9 = U_PDSE1-S12-S3-S: 3.3 Vdc, 0.303 A, 1 W, 10.8~13.2 Vdc Input Range; Manufacturer: CUI; Supplier 1: Newark; RoHS: Yes; Category: Board Mount Modules; Stock 1: 129; Pricing 1: 1=4,23000, 10=4,04000, 25=3,83000, 50=3,61000, 100=3,48000, 250=3,19000 (USD); Supplier Part Number 1: 66AJ7577; Manufacturer Part Number: PDSE1-S12-S3-S
U10 = U_NXJ1S1205MC-R13_14-SMD Module: DC-DC Regulated Power Supply Module; Manufacturer: Murata; Supplier: Digikey; Supplier Part Number: 811-NXJ1S1205MC-R13CT-ND; RoHS: Yes; Category: Board Mount Modules; Stock: 2895; Pricing: 1=3,55, 5=3,53, 10=3,51, 25=3,47, 50=3,38, 100=3,21, 250=3,01, 800=2,80001, 1600=2,63002 (USD); Throw Configuration: DC-DC REGULATED POWER SUPPLY MODULE; Reach SVHC Compliant: Yes; RoHS Compliant: Yes; ComponentLink1URL: https://datasheet.ciiva.com:443/pdfs/VipMasterIC/IC/MUPS/MUPS-S-A0006602135/MUPS-S-A0006602135-1.pdf?src-supplier=IHS+Markit; ComponentLink1Description: https://datasheet.ciiva.com:443/pdfs/VipMasterIC/IC/MUPS/MUPS-S-A0006602135/MUPS-S-A0006602135-1.pdf?src-supplier=IHS+Markit; ComponentLink2URL: https://power.murata.com/data/power/ncl/kdc_nxj1.pdf?src-supplier=Digikey; ComponentLink2Description: https://power.murata.com/data/power/ncl/kdc_nxj1.pdf?src-supplier=Digikey; ComponentLink3URL: https://datasheet.octopart.com/NXJ1S1205MC-R13-Murata-Power-Solutions-datasheet-81842994.pdf?src-supplier=Newark; ComponentLink3Description: https://datasheet.octopart.com/NXJ1S1205MC-R13-Murata-Power-Solutions-datasheet-81842994.pdf?src-supplier=Newark; Manufacturer Part Number: NXJ1S1205MC-R13
U15 = U_TLV75533PDRVR_WSON-6: Fixed Positive LDO Regulator, 3.3V, 0.238V Dropout, PDSO6; Manufacturer: Texas Instruments; Regulator Type: FIXED POSITIVE SINGLE OUTPUT LDO REGULATOR; Supplier: Mouser; Supplier Part Number: 595-TLV75533PDRVR; RoHS: Yes; Category: Voltage Regulators - Linear; Stock: 10505; Pricing: 1=0,34, 10=0,273, 50=0,273, 100=0,203, 1000=0,138, 10000=0,137 (USD); Terminal Finish: Nickel; JESD-609 Code: e4; Moisture Sensitivity Level: 1; Reach SVHC Compliant: Yes; RoHS Compliant: Yes; ComponentLink1URL: https://www.ti.com:443/lit/ds/symlink/tlv755p.pdf?src-supplier=IHS+Markit; ComponentLink1Description: https://www.ti.com:443/lit/ds/symlink/tlv755p.pdf?src-supplier=IHS+Markit; ComponentLink2URL: http://www.ti.com/general/docs/suppproductinfo.tsp?distId=10&amp;gotoUrl=http%3A%2F%2Fwww.ti.com%2Flit%2Fgpn%2Ftlv755p&src-supplier=Digikey; ComponentLink2Description: http://www.ti.com/general/docs/suppproductinfo.tsp?distId=10&amp;gotoUrl=http%3A%2F%2Fwww.ti.com%2Flit%2Fgpn%2Ftlv755p&src-supplier=Digikey; ComponentLink3URL: http://www.ti.com/lit/gpn/tlv755p?src-supplier=Digikey; ComponentLink3Description: http://www.ti.com/lit/gpn/tlv755p?src-supplier=Digikey; Manufacturer Part Number: TLV75533PDRVR